# Altium schematic sheet 1_ADC.SCHDOC
size 297 x 209 mm; SheetNumber: 2; SheetTotal: 18; DocumentName: 1_ADC.SCHDOC
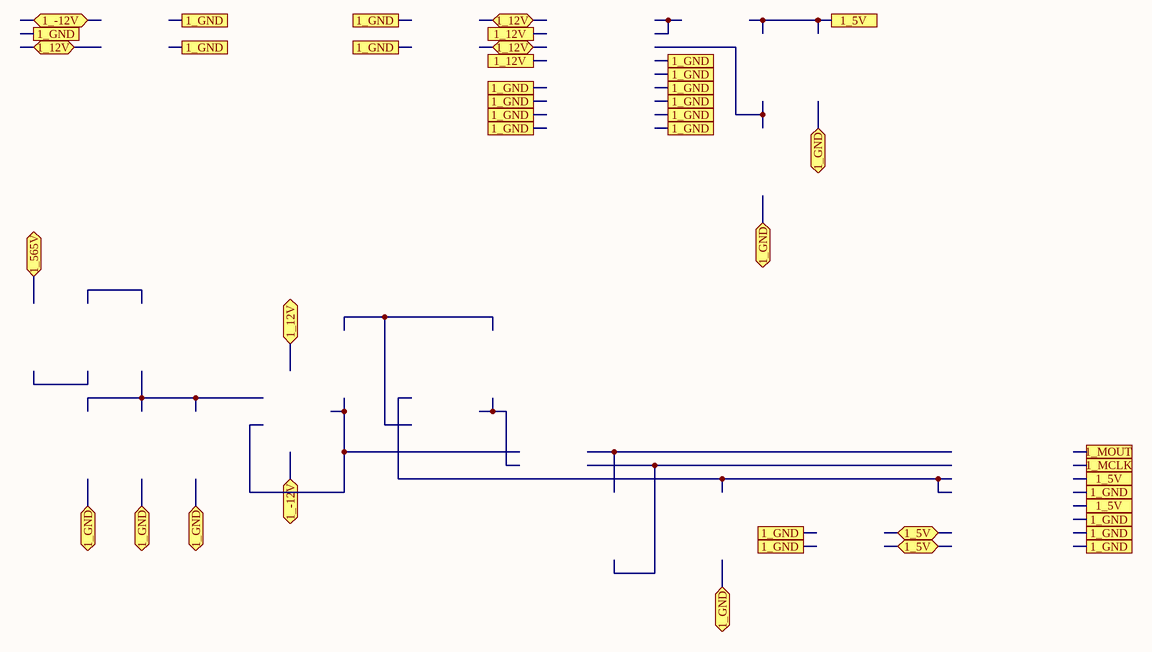
[diagram p0: 1_ADC.SCHDOC]

## Ports
1_5V, 1_5V (bidir), 1_12V, 1_12V (bidir), 1_565V, 1_-12V, 1_-12V (bidir), 1_GND, 1_MCLK, 1_MOUT

## Notes on the sheet
- A
- B
- C
- D
- 1
- 2
- 3
- Title
- 4
- Size
- A4
- Number
- Rev
- Date
- Filename
- Drawn by
- Sheet
- of